# EAGLE design IR (EAGLE 8.4.1)
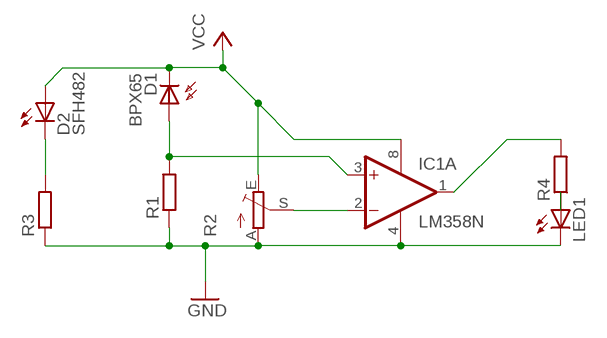
[diagram p0: schematic, sheet 1]

## Parts
D1  BPX65  [BPX65]
D2  SFH482  [SFH482]
IC1  LM358N  [DIL08]
LED1  LED3MM  [LED3MM]
R1  R-EU_0204/7  [0204/7]
R2  TRIM_EU-B25P  [B25P]
R3  R-EU_0204/7  [0204/7]
R4  R-EU_0204/7  [0204/7]

## Nets
GND: IC1.4(P:V-) LED1.K(C) R1.1 R2.A R3.1
N$1: D2.K(C) R3.2
N$3: D1.A IC1.3(A:+IN) R1.2
N$4: IC1.2(A:-IN) R2.S
N$6: IC1.1(A:OUT) R4.2
N$7: LED1.A R4.1
VCC: D1.K(C) D2.A IC1.8(P:V+) R2.E
Unconnected: IC1.5(B:+IN) IC1.6(B:-IN) IC1.7(B:OUT)

## Library data of the parts
D1 = opto-trans-siemens:BPX65: PHOTO DIODE; MPN: BPX65.; OC_FARNELL: 327451; OC_NEWARK: 06WX2764
D2 = led:SFH482: IR LED infrared emitting diode, Infineon
IC1 = linear:LM358: OP AMP also LM158; LM258; LM2904 Source: http://cache.national.com/ds/LM/LM158.pdf
LED1 = adafruit:LED: LED OSRAM: - CHIPLED LG R971, LG N971, LY N971, LG Q971, LY Q971, LO R971, LY R971 LH N974, LH R974 LS Q976, LO Q976, LY Q976 LO Q996 - Hyper CHIPLED LW Q18S LB Q993, LB Q99A, LB R99A - SideLED LS A670, LO A670, LY A670, LG A670, LP A670 LB A673, LV A673, LT A673, LW A673 LH A674 LY A675 LS A676, LA A676, LO A676, LY A676, LW A676 LS A679, LY A679, LG A679 - Hyper Micro SIDELED® LS Y876, LA Y876, LO Y876, LY Y876 LT Y87S - SmartLED LW L88C, LW L88S LB L89C, LB L89S, LG L890 LS L89K, LO L89K, LY L89K LS L896, LA L896, LO L896, LY L896 - TOPLED LS T670, LO T670, LY T670, LG T670, LP T670 LSG T670, LSP T670, LSY T670, LOP T670, LYG T670 LG T671, LOG T671, LSG T671 LB T673, LV T673, LT T673, LW T673 LH T674 LS T676, LA T676, LO T676, LY T676, LB T676, LH T676, LSB T676, LW T676 LB T67C, LV T67C, LT T67C, LS T67K, LO T67K, LY T67K, LW E67C LS E67B, LA E67B, LO E67B, LY E67B, LB E67C, LV E67C, LT E67C LW T67C LS T679, LY T679, LG T679 LS T770, LO T770, LY T770, LG T770, LP T770 LB T773, LV T773, LT T773, LW T773 LH T774 LS E675, LA E675, LY E675, LS T675 LS T776, LA T776, LO T776, LY T776, LB T776 LHGB T686 LT T68C, LB T68C - Hyper Mini TOPLED® LB M676 - Mini TOPLED Santana® LG M470 LS M47K, LO M47K, LY M47K Source: http://www.osram.convergy.de/
R1 R3 R4 = rcl:R-EU_: RESISTOR, European symbol
R2 = pot:TRIM_EU-: POTENTIOMETER

## Board
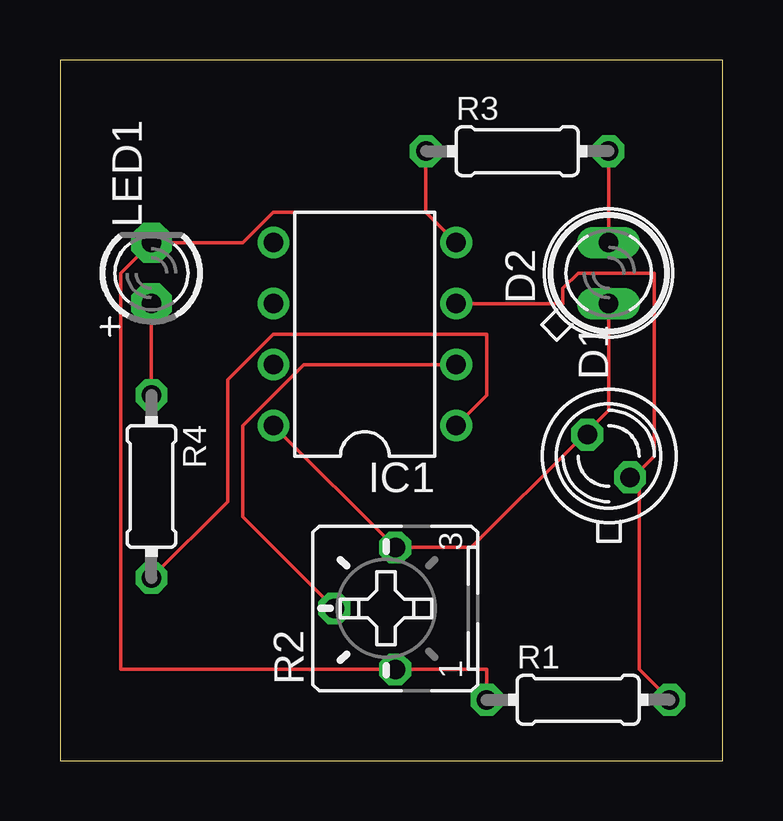
[diagram p1: board, top side]

Size 27.61 x 29.2 mm. Coordinates in mm from the lower left corner, seen from the top.
Outline: 0,0 27.61,0 27.61,29.2 0,29.2 0,0
Copper layers (1*16): Top 0.035mm / dielectric 1.5mm / Bottom 0.035mm
Design rules "default": minimum track width 6mil, minimum drill 0.35mm, track to track 6mil, track to pad 6mil, pad to pad 6mil, via to via 6mil, smd to smd 6mil, copper to edge 40mil, drill to drill 6mil, minimum pad ring 10mil, minimum via ring 8mil, stop-mask expansion 4mil, vias tented up to drill 0mil, thermal gap 10mil

### Footprints (pad centres in the part's own frame; a part is rotated, then mirrored left to right if it is on the bottom)
BPX65 = drill 0.813 octagon: A -0.889,-0.889; K 0.889,0.889
SFH482 = drill 0.813 long: A -1.27,0; K 1.27,0
DIL08 = drill 0.813 pad 1.27: 1 -3.81,-3.81; 2 -1.27,-3.81; 3 1.27,-3.81; 4 3.81,-3.81; 5 3.81,3.81; 6 1.27,3.81; 7 -1.27,3.81; 8 -3.81,3.81
LED3MM = drill 0.813 pad 1.676 octagon: A -1.27,0; K 1.27,0
0204/7 = drill 0.813 octagon: 1 -3.81,0; 2 3.81,0
B25P = drill 0.813 octagon: A -2.54,0; E 2.54,0; S 0,2.54

### Placement (x,y rotation side)
D1  22.86,12.7 90 top
D2  22.86,20.32 90 top
IC1  12.7,17.78 90 top
LED1  3.81,20.32 90 top
R1  21.59,2.54 0 top
R2  13.97,6.35 90 top
R3  19.05,25.4 0 top
R4  3.81,11.43 270 top

### Tracks (layer width: path | path; a pad name or v marks a point on that pad's centre or on a via)
GND
  Top 0.152: R1.1 17.78,3.81 R2.A 2.54,3.81 2.54,20.32 LED1.K 7.62,21.59 8.89,22.86 15.24,22.86 | 15.24,22.86 IC1.4 | R3.1 15.24,22.86
N$1
  Top 0.152: R3.2 D2.K
N$3
  Top 0.152: R1.2 24.13,3.81 24.13,11.43 D1.A 24.13,12.06 24.77,12.7 24.77,20.32 21.59,20.32 20.95,19.69 20.95,19.05 IC1.3
N$4
  Top 0.152: R2.S 7.62,10.16 7.62,13.97 10.16,16.51 IC1.2
N$6
  Top 0.152: R4.2 6.98,10.79 6.98,15.88 8.89,17.78 17.78,17.78 17.78,15.24 IC1.1
N$7
  Top 0.152: LED1.A R4.1
VCC
  Top 0.152: D2.A 22.86,14.6 22.23,13.97 D1.K 21.59,13.34 17.14,8.89 R2.E IC1.8